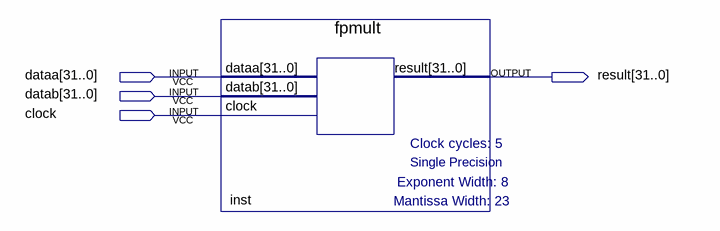
[diagram p0: schematic sheet]
// Quartus schematic fp32Bit_mult.bdf as structural Verilog: 1 symbols, 4 pins
module fp32Bit_mult (
  input  [31:0] dataa,
  input  [31:0] datab,
  input  clock,
  output [31:0] result
);

  fpmult inst (.dataa(dataa), .datab(datab), .clock(clock), .result(result));
endmodule
